# EAGLE design DG5-shield_v1_5 (EAGLE 7.1.0)
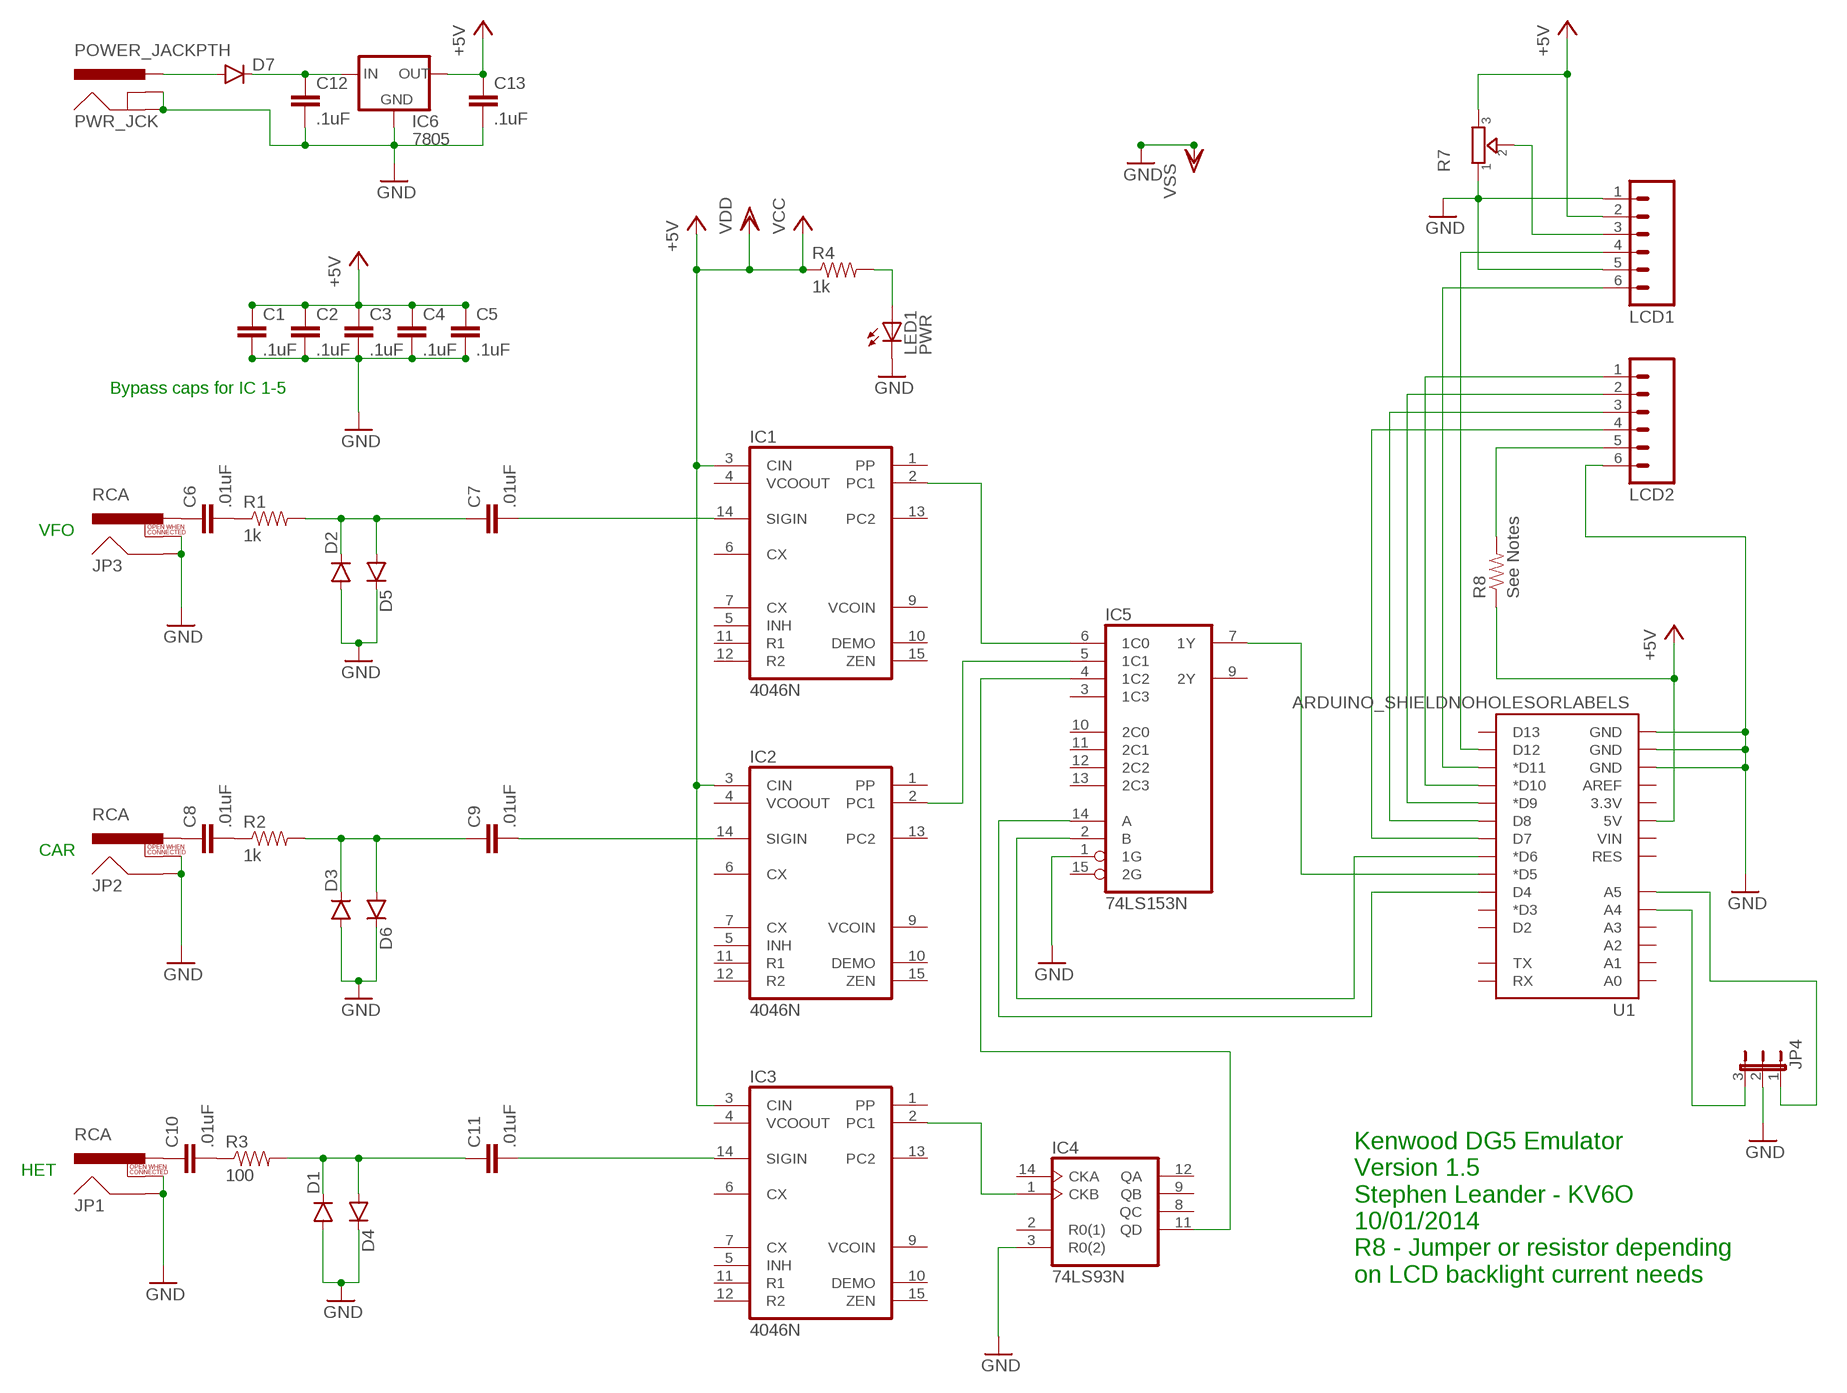
[diagram p0: schematic, sheet 1]

## Parts
C1  .1uF  CAPKIT  [CAP-PTH-SMALL-KIT]
C2  .1uF  CAPKIT  [CAP-PTH-SMALL-KIT]
C3  .1uF  CAPKIT  [CAP-PTH-SMALL-KIT]
C4  .1uF  CAPKIT  [CAP-PTH-SMALL-KIT]
C5  .1uF  CAPKIT  [CAP-PTH-SMALL-KIT]
C6  .01uF  CAPKIT  [CAP-PTH-SMALL-KIT]
C7  .01uF  CAPKIT  [CAP-PTH-SMALL-KIT]
C8  .01uF  CAPKIT  [CAP-PTH-SMALL-KIT]
C9  .01uF  CAPKIT  [CAP-PTH-SMALL-KIT]
C10  .01uF  CAPKIT  [CAP-PTH-SMALL-KIT]
C11  .01uF  CAPKIT  [CAP-PTH-SMALL-KIT]
C12  .1uF  CAPKIT  [CAP-PTH-SMALL-KIT]
C13  .1uF  CAPKIT  [CAP-PTH-SMALL-KIT]
D1  DIODE1N4148  [DIODE-1N4148]
D2  DIODE1N4148  [DIODE-1N4148]
D3  DIODE1N4148  [DIODE-1N4148]
D4  DIODE1N4148  [DIODE-1N4148]
D5  DIODE1N4148  [DIODE-1N4148]
D6  DIODE1N4148  [DIODE-1N4148]
D7  DIODE  [DIODE-1N4001-KIT]
IC1  4046N  [DIL16]
IC2  4046N  [DIL16]
IC3  4046N  [DIL16]
IC4  74LS93N  [DIL14]
IC5  74LS153N  [DIL16]
IC6  7805  V_REG_78XXSINK  [TO220-IGO]
JP1  RCA  [RCA]
JP2  RCA  [RCA]
JP3  RCA  [RCA]
JP4  JP2E  [JP2]
LCD1  M06SIP  [1X06]
LCD2  M06SIP  [1X06]
LED1  PWR  TLLG4400  [LED3MM]
PWR_JCK  POWER_JACKPTH  [POWER_JACK_PTH]
R1  1k  RESISTORPTH-1/6W  [1/6W-RES]
R2  1k  RESISTORPTH-1/6W  [1/6W-RES]
R3  100  RESISTORPTH-1/6W  [1/6W-RES]
R4  1k  RESISTORPTH-1/6W  [1/6W-RES]
R7  TRIMMER-3306F  [TRIMMER_3306F]
R8  See Notes  RESISTORPTH-1/6W  [1/6W-RES]
U1  ARDUINO_SHIELDNOHOLESORLABELS  [DUEMILANOVE_SHIELD_NOHOLES_NOLABELS]

## Nets
+5V [POWER]: C1.1 C2.1 C3.1 C4.1 C5.1 C13.1 IC1.3(CIN) IC2.3(CIN) IC3.3(CIN) IC6.OUT LCD1.2 R4.1 R7.3 R8.1 U1.5V ; supply symbol labelled VDD, VCC
GND: C1.2 C2.2 C3.2 C4.2 C5.2 C12.2 C13.2 D1.A D2.A D3.A D4.C D5.C D6.C IC4.3(R0(2)) IC5.1(1G) IC6.GND JP1.SHELL JP1.SWITCH JP2.SHELL JP2.SWITCH JP3.SHELL JP3.SWITCH JP4.2 LCD1.1 LCD1.5 LCD2.6 LED1.K(C) PWR_JCK.GND PWR_JCK.GNDBREAK R7.1 U1.GND@0(GND) U1.GND@1(GND) U1.GND@2(GND) ; supply symbol labelled VSS
N$1: C7.2 IC1.14(SIGIN)
N$2: IC1.2(PC1) IC5.6(1C0)
N$3: IC2.2(PC1) IC5.5(1C1)
N$4: C8.2 R2.1
N$5: C6.2 R1.1
N$6: C7.1 D2.C D5.A R1.2
N$7: IC3.2(PC1) IC4.1(CKB)
N$8: IC4.11(QD) IC5.4(1C2)
N$9: C9.1 D3.C D6.A R2.2
N$10: C10.1 JP1.PIN
N$11: C9.2 IC2.14(SIGIN)
N$12: C11.2 IC3.14(SIGIN)
N$13: C11.1 D1.C D4.A R3.2
N$14: C10.2 R3.1
N$15: C8.1 JP2.PIN
N$16: C6.1 JP3.PIN
N$18: IC5.14(A) U1.D4
N$19: IC5.7(1Y) U1.D5(*D5)
N$20: LCD2.2 U1.D9(*D9)
N$21: LED1.A R4.2
N$22: JP4.1 U1.A5
N$23: JP4.3 U1.A4
N$24: LCD2.4 U1.D7
N$25: LCD2.5 R8.2
N$26: LCD1.3 R7.2
N$27: LCD1.4 U1.D12
N$28: LCD1.6 U1.D11(*D11)
N$29: LCD2.1 U1.D10(*D10)
N$30: LCD2.3 U1.D8
N$31: IC5.2(B) U1.D6(*D6)
N$32: D7.A PWR_JCK.PWR
VIN [POWER]: C12.1 D7.C IC6.IN
Unconnected: IC1.1(PP) IC1.4(VCOOUT) IC1.5(INH) IC1.6(CX) IC1.7(CX) IC1.9(VCOIN) IC1.10(DEMO) IC1.11(R1) IC1.12(R2) IC1.13(PC2) IC1.15(ZEN) IC2.1(PP) IC2.4(VCOOUT) IC2.5(INH) IC2.6(CX) IC2.7(CX) IC2.9(VCOIN) IC2.10(DEMO) IC2.11(R1) IC2.12(R2) IC2.13(PC2) IC2.15(ZEN) IC3.1(PP) IC3.4(VCOOUT) IC3.5(INH) IC3.6(CX) IC3.7(CX) IC3.9(VCOIN) IC3.10(DEMO) IC3.11(R1) IC3.12(R2) IC3.13(PC2) IC3.15(ZEN) IC4.2(R0(1)) IC4.8(QC) IC4.9(QB) IC4.12(QA) IC4.14(CKA) IC5.3(1C3) IC5.9(2Y) IC5.10(2C0) IC5.11(2C1) IC5.12(2C2) IC5.13(2C3) IC5.15(2G) U1.3.3V U1.A0 U1.A1 U1.A2 U1.A3 U1.AREF U1.D2 U1.D3(*D3) U1.D13 U1.RES U1.RX U1.TX U1.VIN

## Notes on the sheet
- Bypass caps for IC 1-5
- VFO
- CAR
- HET
- Kenwood DG5 Emulator
  Version 1.5
  Stephen Leander - KV6O
  10/01/2014
  R8 - Jumper or resistor depending 
  on LCD backlight current needs

## Power pins joined to a net without a drawn wire
+5V: IC1.16(VDD) IC2.16(VDD) IC3.16(VDD) IC4.5(VCC) IC5.16(VCC)
GND: IC1.8(VSS) IC2.8(VSS) IC3.8(VSS) IC4.10(GND) IC5.8(GND)

## Library data of the parts
C1-C13 = SparkFun-Passives:CAP: Capacitor Standard 0603 ceramic capacitor, and 0.1" leaded capacitor.
D1-D7 = SparkFun-DiscreteSemi:DIODE: Diode These are standard reverse protection diodes and small signal diodes. SMA package can handle up to about 1A. SOD-323 can handle about 200mA. What the SOD-323 package when ordering, there are some mfgs out there that are 5-pin packages.
IC1-IC3 = 40xx:4046: Micropower PLL
IC4 = 74xx-us:74*93: Decade, divide by twelve and binary COUNTER
IC5 = 74xx-us:74*153: Dual 4-line to 1-line data SELECTOR/MULTIPLEXER
IC6 = SparkFun-PowerIC:V_REG_78XX: Voltage Regulator Standard 7805 5V regulator. IGO (Input Ground Output). Spark Fun Electronics SKU : COM-00107
JP1-JP3 = SparkFun-Connectors:RCA
JP4 = jumper:JP2E: JUMPER
LCD1 LCD2 = SparkFun-Connectors:M06: Header 6 Standard 6-pin 0.1" header. Use with straight break away headers (SKU : PRT-00116), right angle break away headers (PRT-00553), swiss pins (PRT-00743), machine pins (PRT-00117), and female headers (PRT-00115). Molex polarized connector foot print use with SKU : PRT-08094 with associated crimp pins and housings. NOTES ON THE VARIANTS LOCK and LOCK_LONGPADS... This footprint was designed to help hold the alignment of a through-hole component (i.e. 6-pin header) while soldering it into place. You may notice that each hole has been shifted either up or down by 0.005 of an inch from it's more standard position (which is a perfectly straight line). This slight alteration caused the pins (the squares in the middle) to touch the edges of the holes. Because they are alternating, it causes a "brace" to hold the component in place. 0.005 has proven to be the perfect amount of "off-center" position when using our standard breakaway headers. Although looks a little odd when you look at the bare footprint, once you have a header in there, the alteration is very hard to notice. Also,if you push a header all the way into place, it is covered up entirely on the bottom side. This idea of altering the position of holes to aid alignment will be further integrated into the Sparkfun Library for other footprints. It can help hold any component with 3 or more connection pins.
LED1 = led:TLLG4400: Low Current (2mA) LED 3 mm Tinted Diffused Package color GREEN Source: Data sheet <http://www.farnell.com/datasheets/391098.pdf>; MF: VISHAY SEMICONDUCTOR; OC_FARNELL: 1612435
PWR_JCK = SparkFun-Connectors:POWER_JACK: Power Jack This is the standard 5.5mm barrel jack for power. The PTH is the most common, proven, reliable, footprint. The Slot footprint only works if the mill layer is transmitted to the PCB fab house so be warned. Mating wall wart : TOL-00298 (and others); PROD_ID: PRT-00119
R1-R4 R8 = SparkFun-Passives:RESISTOR: Resistor Basic schematic elements and footprints for 0603, 1206, and PTH resistors.
R7 = dp_devices:TRIMMER: Trimmer resistor
U1 = SparkFun-Boards:ARDUINO_SHIELD: Arduino shield footprint

## Net classes
0 default: width 0.203 mm
1 POWER: width 0.305 mm

## Board
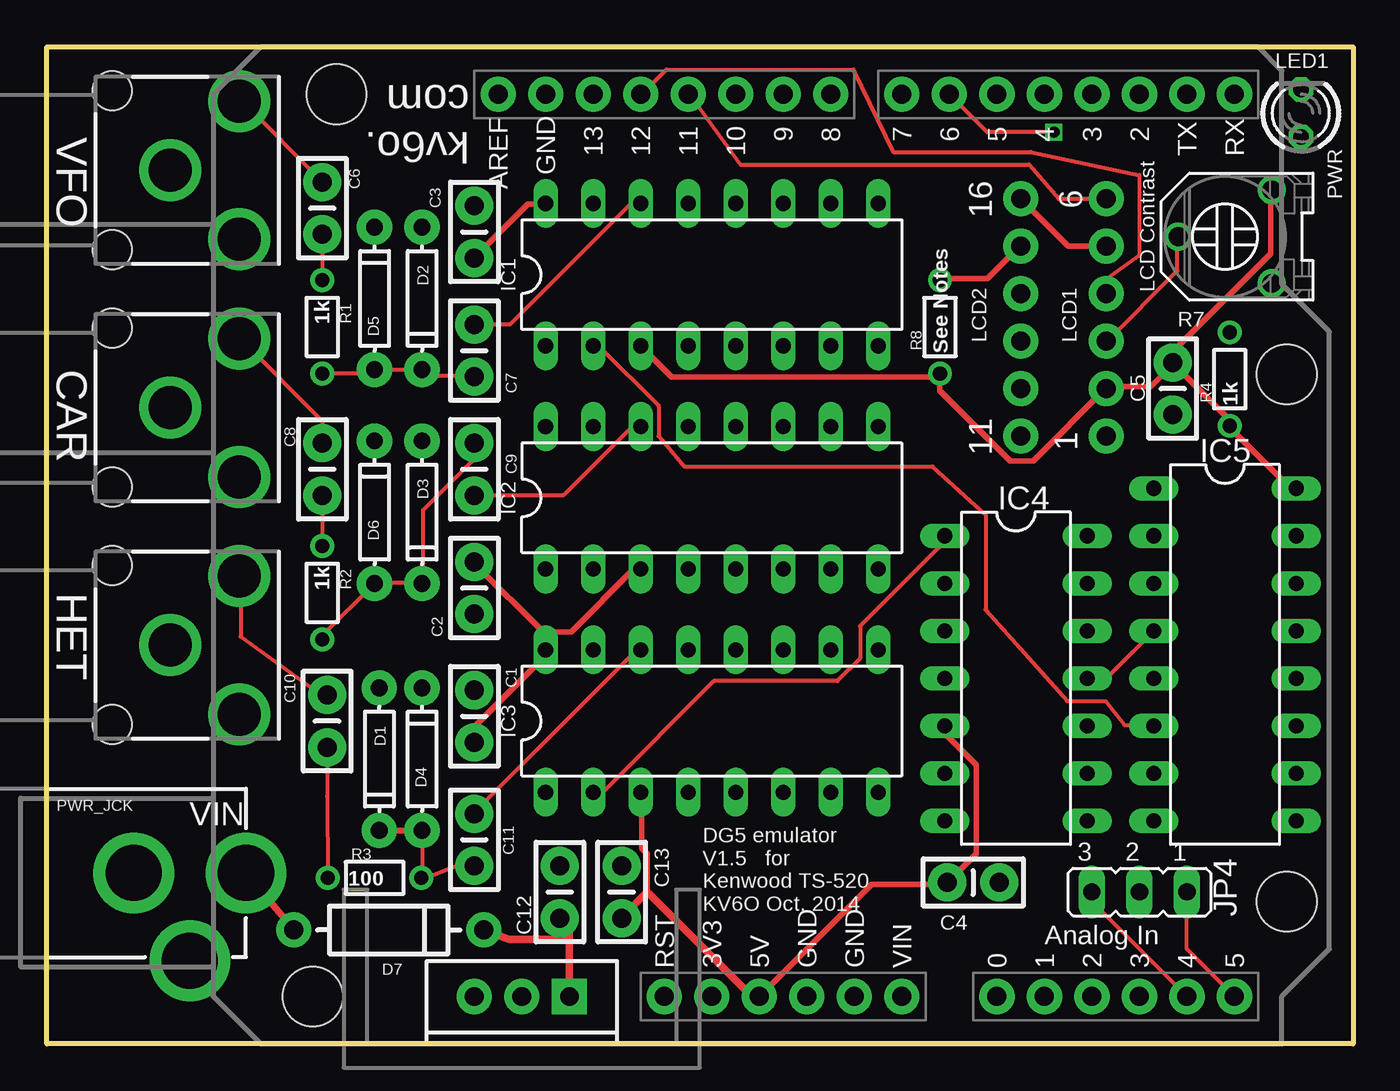
[diagram p1: board, top side]
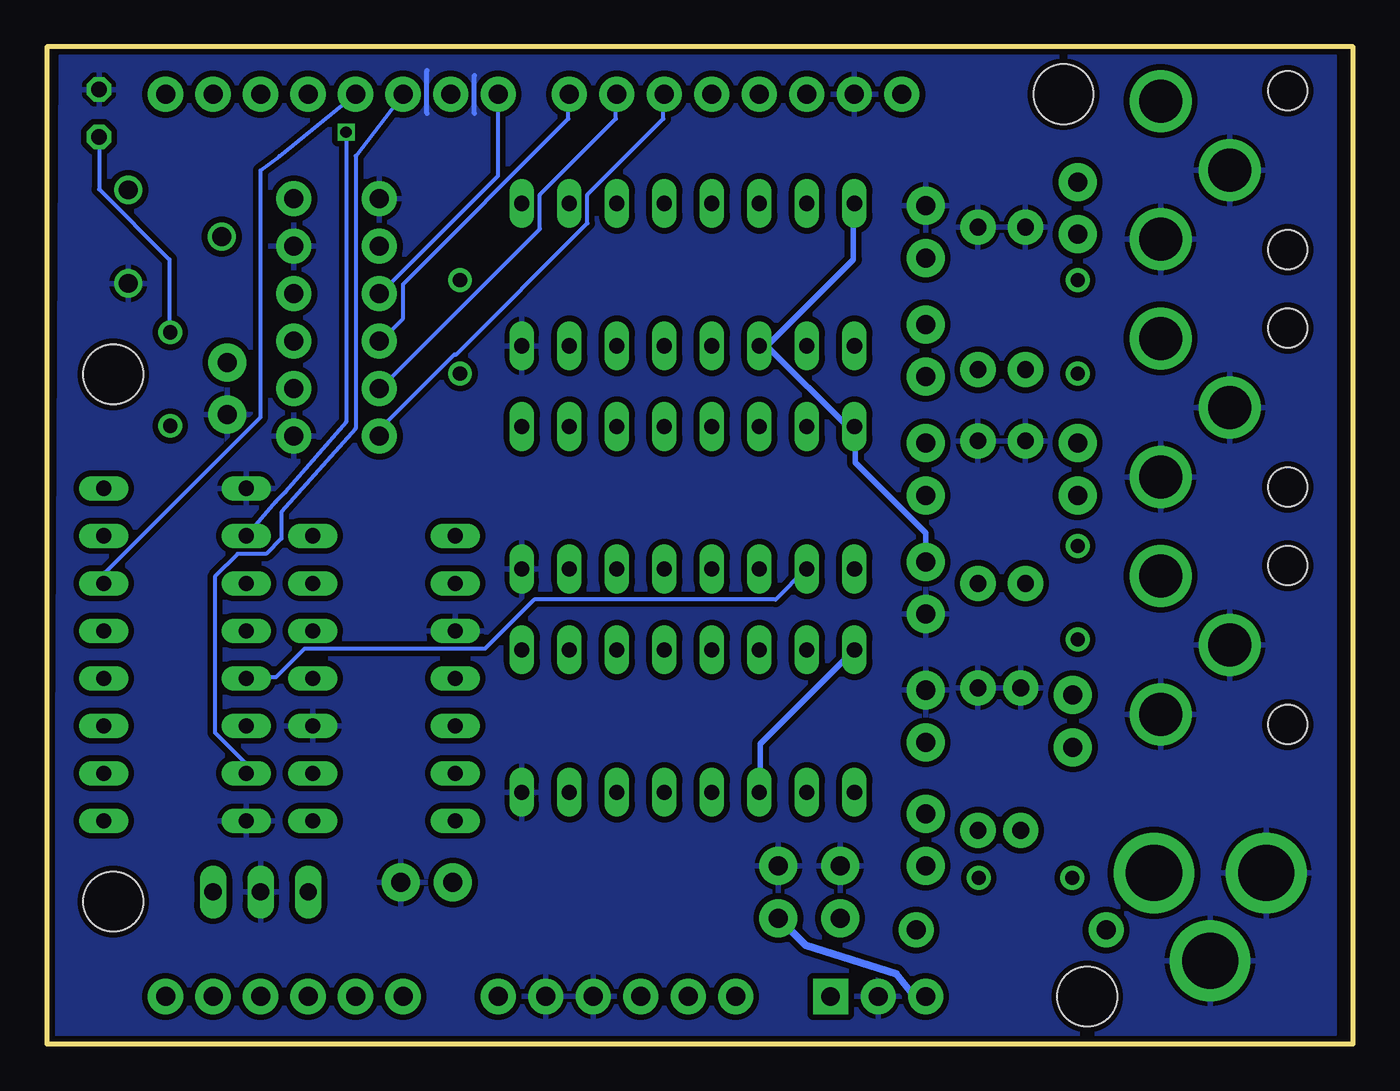
[diagram p2: board, bottom side, seen from below]

Size 69.85 x 53.34 mm. Coordinates in mm from the lower left corner, seen from the top.
Outline: 0,0 0,53.34 69.85,53.34 69.85,0 0,0
Copper layers (1*16): Top 0.035mm / dielectric 1.5mm / Bottom 0.035mm
Design rules "ITEADstudio_DRC *": minimum track width 8mil, minimum drill 12mil, track to track 8mil, track to pad 8mil, pad to pad 8mil, via to via 8mil, smd to smd 0mil, copper to edge 10mil, drill to drill 10mil, minimum pad ring 10mil, minimum via ring 6mil, stop-mask expansion 2mil, vias tented up to drill 100mil, thermal gap 10mil
Holes 3.2 mm at 15.49,50.8 14.22,2.54 66.29,7.62 66.29,35.81

### Footprints (pad centres in the part's own frame; a part is rotated, then mirrored left to right if it is on the bottom)
CAP-PTH-SMALL-KIT = drill 1.016 pad 2.032: 1 -1.397,0; 2 1.397,0
DIODE-1N4148 = drill 0.9 pad 1.88: A -3.81,0; C 3.81,0
DIODE-1N4001-KIT = drill 1.016 pad 1.88: A -5.08,0; C 5.08,0
DIL16 = drill 0.813 long: 1 -8.89,-3.81; 2 -6.35,-3.81; 3 -3.81,-3.81; 4 -1.27,-3.81; 5 1.27,-3.81; 6 3.81,-3.81; 7 6.35,-3.81; 8 8.89,-3.81; 9 8.89,3.81; 10 6.35,3.81; 11 3.81,3.81; 12 1.27,3.81; 13 -1.27,3.81; 14 -3.81,3.81; 15 -6.35,3.81; 16 -8.89,3.81
DIL14 = drill 0.813 long: 1 -7.62,-3.81; 2 -5.08,-3.81; 3 -2.54,-3.81; 4 0,-3.81; 5 2.54,-3.81; 6 5.08,-3.81; 7 7.62,-3.81; 8 7.62,3.81; 9 5.08,3.81; 10 2.54,3.81; 11 0,3.81; 12 -2.54,3.81; 13 -5.08,3.81; 14 -7.62,3.81
TO220-IGO = drill 1 pad 1.88: GND 0,0; OUT 2.54,0 | drill 1 pad 1.88 square: IN -2.54,0
RCA = drill 2.3: PIN 3.7,3.7; SHELL 0,0; SWITCH 3.7,-3.7 | hole 2.1: -3.1,4.25; -3.1,-4.25
JP2 = drill 0.914 long: 1 -2.54,0; 2 0,0; 3 2.54,0
1X06 = drill 1.016 pad 1.88: 1 0,0; 2 2.54,0; 3 5.08,0; 4 7.62,0; 5 10.16,0; 6 12.7,0
LED3MM = drill 0.813 octagon: A -1.27,0; K 1.27,0
POWER_JACK_PTH = drill 2.997 pad 4.318: GND 0,7.7; GNDBREAK 4.7,10.7; PWR 0,13.7
1/6W-RES = drill 0.762: 1 -2.5,0; 2 2.5,0
TRIMMER_3306F = drill 1: 1 -2.5,-2.5; 2 0,2.5; 3 2.5,-2.5
DUEMILANOVE_SHIELD_NOHOLES_NOLABELS = drill 1.016 pad 1.88: 3.3V 50.8,26.67; 5V 50.8,29.21; A0 50.8,41.91; A1 50.8,44.45; A2 50.8,46.99; A3 50.8,49.53; A4 50.8,52.07; A5 50.8,54.61; AREF 2.54,15.24; D2 2.54,49.53; D3 2.54,46.99; D4 2.54,44.45; D5 2.54,41.91; D6 2.54,39.37; D7 2.54,36.83; D8 2.54,33.02; D9 2.54,30.48; D10 2.54,27.94; D11 2.54,25.4; D12 2.54,22.86; D13 2.54,20.32; GND@0 50.8,31.75; GND@1 50.8,34.29; GND@2 2.54,17.78; RES 50.8,24.13; RX 2.54,54.61; TX 2.54,52.07; VIN 50.8,36.83

### Placement (x,y rotation side)
C1  22.86,17.53 90 top
C2  22.86,24.38 270 top
C3  22.86,43.43 90 top
C4  49.53,8.64 0 top
C5  60.2,35.05 270 top
C6  14.73,44.7 270 top
C7  22.86,37.08 90 top
C8  14.73,30.73 270 top
C9  22.86,30.73 270 top
C10  14.99,17.27 270 top
C11  22.86,10.92 90 top
C12  27.43,8.13 90 top
C13  30.73,8.13 90 top
D1  17.78,15.24 270 top
D2  20.07,39.88 270 top
D3  20.07,28.45 270 top
D4  20.07,15.24 90 top
D5  17.53,39.88 90 top
D6  17.53,28.45 90 top
D7  18.29,6.1 0 top
IC1  35.56,41.15 0 top
IC2  35.56,29.21 0 top
IC3  35.56,17.27 0 top
IC4  51.82,19.56 270 top
IC5  62.99,20.83 270 top
IC6  25.4,2.54 180 top
JP1  6.6,21.34 0 top
JP2  6.6,34.04 0 top
JP3  6.6,46.74 0 top
JP4  58.42,8.13 180 top
LCD1  56.64,32.51 90 top
LCD2  52.07,32.51 90 top
LED1  67.06,49.78 90 top
PWR_JCK  -3.05,9.14 270 top
R1  14.73,38.35 270 top
R2  14.73,24.13 270 top
R3  17.53,8.89 0 top
R4  63.25,35.56 90 top
R7  62.99,43.18 90 top
R8  47.75,38.35 90 top
U1  8.89,53.34 270 top

### Tracks (layer width: path | path; a pad name or v marks a point on that pad's centre or on a via)
+5V
  Top 0.305: IC4.5 48.06,16.97 48.06,16.56 49.68,14.94 49.68,10.16 48.16,8.64 C4.1 48.06,8.53 44.09,8.53 38.2,2.64 U1.5V 37.69,2.54 | IC3.3 31.8,13.41 31.8,10.46 32.11,10.16 32.11,8.13 32.21,8.03 | 30.79,6.81 C13.1 | C5.1 60.25,36.37 63.2,33.43 63.2,33.12 R4.1 63.3,32.92 66.45,29.77 66.75,29.77 IC5.16 | R7.3 65.43,45.62 65.43,42.27 60.25,37.08 60.25,36.58 C5.1 | C5.1 60.15,36.27 59.03,35.15 56.69,35.15 LCD1.2 56.59,35.05 52.73,31.19 51.51,31.19 47.75,34.95 47.75,35.76 R8.1 47.65,35.66 33.43,35.66 31.8,37.29 IC1.3 | IC3.16 26.62,21.13 26.62,21.95 22.86,25.7 C2.1 | IC2.3 31.7,25.4 31.39,25.4 28.04,22.05 26.72,22.05 IC3.16 | C1.1 22.86,16.15 22.86,16.97 26.72,20.83 26.72,20.93 IC3.16 | IC1.16 26.62,44.91 25.7,44.91 22.86,42.06 C3.1
  Top 0.406: 30.79,6.81 32.11,8.13 | 32.21,8.03 37.69,2.54
  Bottom 0.305: 30.68,6.71 C13.1 | IC1.16 26.72,44.91 26.72,41.96 31.29,37.39 IC1.3 31.7,37.29 31.29,37.29 27.03,33.02 26.72,33.02 IC2.16 26.62,32.92 26.62,31.09 22.86,27.33 22.86,25.81 C2.1 | IC3.3 31.7,13.51 31.7,16.05 26.72,21.03 IC3.16
  Bottom 0.406: IC6.OUT 23.47,2.54 24.43,3.76 29.26,5.28 30.68,6.71
GND
  Top 0.305: LCD2.6 54.61,42.67 LCD1.5
  Bottom 0.254: 46.99,49.78 46.99,51.82 | 49.53,49.78 49.53,52.07
  pour Bottom (isolate 0.305): 1.02,52.83 1.02,0.51 69.34,0.51 69.09,52.83
N$1
  Top 0.203: IC1.14 31.7,44.91 31.19,44.91 24.79,38.51 22.86,38.51 C7.2
N$2
  Top 0.203: IC5.6 59.13,17.07 57.61,17.07 56.59,18.34 54.56,18.34 50.19,23.22 50.19,28.3 47.35,30.89 34.09,30.89 32.72,32.51 32.72,34.14 29.57,37.29 29.26,37.29 IC1.2
N$3
  Bottom 0.203: IC5.5 59.13,19.61 57.61,19.61 56.08,21.13 46.43,21.13 43.79,23.77 30.89,23.77 29.26,25.4 IC2.2
N$4
  Top 0.203: R2.1 14.73,26.72 14.73,29.26 C8.2
N$5
  Top 0.203: R1.1 14.73,40.95 14.73,43.28 C6.2
N$6
  Top 0.203: R1.2 14.73,35.87 17.27,35.87 17.48,36.07 D5.A 17.58,36.07 20.02,36.07 D2.C 20.12,36.07 20.42,35.76 22.86,35.76 C7.1
N$7
  Top 0.203: IC3.2 29.26,13.51 29.77,13.51 35.66,19.41 42.27,19.41 43.48,20.62 43.48,22.35 47.95,26.82 47.95,27.13 IC4.1
N$8
  Top 0.203: IC4.11 55.68,19.61 56.69,19.61 59.13,22.05 IC5.4
N$9
  Top 0.203: R2.2 14.73,21.84 17.48,24.59 D6.A 17.58,24.69 20.02,24.69 D3.C 20.12,24.69 20.12,28.55 22.86,31.29 22.86,32.11 C9.1
N$10
  Top 0.203: C10.1 14.94,18.49 10.36,21.79 10.36,24.99 JP1.PIN
N$11
  Top 0.203: IC2.14 31.7,33.02 31.29,33.02 27.64,29.36 22.86,29.36 C9.2
N$12
  Top 0.203: IC3.14 31.7,21.03 31.5,21.03 22.86,12.39 C11.2
N$13
  Top 0.203: R3.2 20.07,8.94 20.07,11.38 17.78,11.38 D1.C 17.78,11.48 20.02,11.48 D4.A 20.12,8.84 21.95,9.55 22.86,9.55 C11.1
N$14
  Top 0.203: R3.1 14.99,13.26 14.99,15.34 15.04,15.54 C10.2
N$15
  Top 0.203: C8.1 14.73,32.21 14.73,33.33 10.36,37.69 JP2.PIN
N$16
  Top 0.203: C6.1 14.73,46.13 10.36,50.49 JP3.PIN
N$18
  Bottom 0.203: IC5.14 66.75,24.69 66.75,25.2 58.42,33.53 58.42,46.74 57.4,47.5 U1.D4
N$19
  Bottom 0.203: U1.D5 53.34,47.5 53.34,32.92 57.3,28.45 57.3,27.03 58.12,26.21 59.64,26.21 60.86,24.99 60.86,16.66 59.23,15.04 59.23,14.53 IC5.7
N$20
  Bottom 0.203: U1.D9 39.42,50.8 39.42,49.48 43.48,45.41 43.48,43.59 52.02,35.05 LCD2.2
N$21
  Bottom 0.203: R4.2 63.3,38.1 63.3,41.96 67.06,45.72 67.06,48.46 LED1.A
N$22
  Top 0.203: JP4.1 60.96,5.08 U1.A5
N$23
  Top 0.203: JP4.3 55.88,7.62 U1.A4
N$24
  Bottom 0.203: U1.D7 45.72,46.43 52.02,40.13 LCD2.4
N$25
  Top 0.203: 47.75,40.95 R8.2 | 52.02,42.67 LCD2.5
  Top 0.305: 47.75,40.95 50.29,40.95 52.02,42.67
N$26
  Top 0.203: R7.2 60.45,43.18 60.45,41.35 56.69,37.59 LCD1.3
N$27
  Top 0.203: LCD1.4 56.69,40.13 56.69,40.95 58.42,42.16 58.42,46.48 52.63,47.7 45.26,47.7 43.13,52.12 33.12,52.12 31.8,50.8 U1.D12
N$28
  Top 0.203: LCD1.6 56.59,45.21 54.1,45.21 52.53,47.04 37.08,47.04 34.34,50.8 U1.D11
N$29
  Bottom 0.203: U1.D10 36.88,50.8 36.88,49.48 40.95,45.41 40.95,43.89 47.95,36.88 48.06,36.88 52.02,32.92 52.02,32.51 LCD2.1
N$30
  Bottom 0.203: U1.D8 41.96,50.8 41.96,49.48 50.8,40.64 50.8,38.81 52.02,37.59 LCD2.3
N$31  (via drill 0.6)
  Top 0.203: v53.85,48.77 50.29,48.77 U1.D6
  Bottom 0.203: v53.85,48.77 53.85,33.27 57.1,29.52 57.61,29.01 IC5.2
N$32
  Top 0.203: D7.A 13.16,5.59 | 10.67,9.14 PWR_JCK.PWR
  Top 0.406: 10.67,9.14 D7.A 13.16,5.59
VIN
  Top 0.305: 27.43,6.71 C12.1 | 27.84,5.59 27.94,5.59
  Top 0.406: IC6.IN 27.94,5.59 27.94,6.2 27.43,6.71 | 27.84,5.59 24.69,5.59 D7.C

### Text on the board
tNames: kv6o. / com | VFO | 9 | 8 | 7 | 6 | 5 | 4 | 3 | 2 | 13 | 12 | 11 | 10 | LCD Contrast | TX | RX | AREF | GND | 6 | 16 | CAR | 1 | 11 | HET | VIN | C13 | DG5 emulator / V1.5 for / Kenwood TS-520 / KV6O Oct. 2014 | C12 | Analog In | RST | 3V3 | 5V | GND | GND | VIN | 0 | 1 | 2 | 3 | 4 | 5